# Altium schematic sheet RF.SchDoc
size A4; SheetNumber: 1; SheetTotal: 2
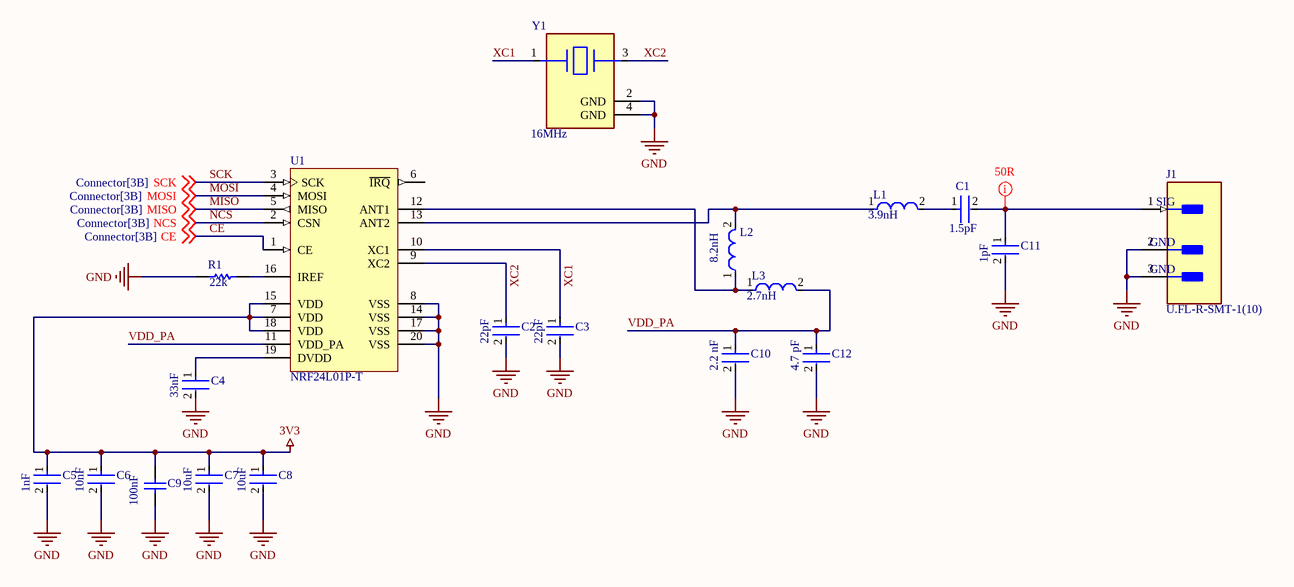
[diagram p0: RF.SchDoc]

## Parts
C1  Capacitance: 1.5pF  [FP-GCM155-0_05-IPC_C]  (hidden comment: GCM1555C1H1R5BA16D)
C2  Capacitance: 22pF  [FP-0402-L_1_0_1-W_0_5_0_1-MFG]  (hidden comment: 04025A220JAT2A)
C3  Capacitance: 22pF  [FP-0402-L_1_0_1-W_0_5_0_1-MFG]  (hidden comment: 04025A220JAT2A)
C4  Capacitance: 33nF  [FP-GCM155-0_05-IPC_A]  (hidden comment: GCM155R71E333KA55D)
C5  Capacitance: 1nF  [FP-CL957-IPC_C]  (hidden comment: CL05B102KB5NNNC)
C6  Capacitance: 10nF  [FP-CL165-IPC_C]  (hidden comment: CL05B103KB5NNNC)
C7  Capacitance: 10uF  [FP-LMK107BJ106MALTD-MFG]  (hidden comment: LMK107BJ106MALTD)
C8  Capacitance: 10uF  [FP-LMK107BJ106MALTD-MFG]  (hidden comment: LMK107BJ106MALTD)
C9  value 100nF  [CAPC1050X55X23ML05T13]  (hidden comment: CL05B104KO5NNNC)
C10  value 2.2 nF  [FP-CC0402-MFG]  (hidden comment: CC0402KRX7R9BB222)
C11  Capacitance: 1pF  [FP-GJM155-0_05-IPC_B]  (hidden comment: GJM1555C1H1R0WB01D)
C12  value 4.7 pF  [FP-AC0402-0_5-MFG]  (hidden comment: AC0402CRNPO9BN4R7)
J1  U.FL-R-SMT-1(10)  [FP-U_FL-R-SMT-1_10-MFG]
L1  Inductance: 3.9nH  [FP-LQW15AN_00-W0_6-0_1-MFG]  (hidden comment: LQW15AN3N9B00D)
L2  Inductance: 8.2nH  [FP-LQW15AN_00-W0_6-0_1-MFG]  (hidden comment: LQW15AN8N2G00D)
L3  Inductance: 2.7nH  [FP-LQW15AN_00-W0_6-0_1-MFG]  (hidden comment: LQW15AN2N7B00D)
R1  value 22k  [RESC1005X40X25NL05T10]  (hidden comment: RC0402FR-0722KL)
U1  NRF24L01P-T  [NRSC-QFN-20_L]
Y1  Frequency: 16MHz  [FP-ABM11-MFG]  (hidden comment: X201616MPB4SC)

## Nets
3V3: C5.1 C6.1 C7.1 C8.1 C9.1 U1.7(VDD) U1.15(VDD) U1.18(VDD)
GND: C2.2 C3.2 C4.2 C5.2 C6.2 C7.2 C8.2 C9.2 C10.2 C11.2 C12.2 J1.2(GND) J1.3(GND) R1.1 U1.8(VSS) U1.14(VSS) U1.17(VSS) U1.20(VSS) Y1.2(GND) Y1.4(GND)
CE: U1.1(CE) ; off-sheet CE
MISO: U1.5(MISO) ; off-sheet MISO
MOSI: U1.4(MOSI) ; off-sheet MOSI
NCS: U1.2(CSN) ; off-sheet NCS
SCK: U1.3(SCK) ; off-sheet SCK
VDD_PA: C10.1 C12.1 L3.2 U1.11(VDD_PA)
XC1: C3.1 U1.10(XC1) Y1.1
XC2: C2.1 U1.9(XC2) Y1.3
NetC1_1: C1.1 L1.2
NetC1_2: C1.2 C11.1 J1.1(SIG)
NetC4_1: C4.1 U1.19(DVDD)
NetL1_1: L1.1 L2.2 U1.13(ANT2)
NetL2_1: L2.1 L3.1 U1.12(ANT1)
NetR1_2: R1.2 U1.16(IREF)

Not connected (* = marked no-connect by the designer): U1 6(~{IRQ})

## Layout directives
net class 50R: NetC1_2

## Library data of the parts
C1 = CMP-06035-019024-1: Ceramic Capacitor for Automotive 1.5pF ±0.1pF 50VDC C0G 0402 Paper T/R; Voltage Rating: 50V; Packaging: Tape and Reel; Case Code (Metric): 1005; Mount: Surface Mount; Max Operating Temperature: 125°C; Case/Package: 0402; Min Operating Temperature: -55°C; Case Code (Imperial): 0402; Ratings: AEC-Q200; JLCPartNum: C126500
C2 C3 = CMP-2008-02613-2: General Purpose Ceramic Capacitor, 0402, 22pF, 5%, C0G, 30ppm/°C, 50V; Temperature Coefficient: 30ppm/°C; Mount: Surface Mount; Length: 1mm; Construction: Flat; Contact Plating: Tin; REACH SVHC: No SVHC; Case/Package: 0402; Voltage: 50V; Case Code (Imperial): 0402; Thickness: 0.022inch; Radiation Hardening: No; Number of Pins: 2; Tolerance: 5%; Max Operating Temperature: 125°C; RoHS Compliant: Yes; Voltage Rating: 50V; Case Code (Metric): 1005; Package Quantity: 1; Width: 0.02inch; Termination: SMD/SMT; Lead Free: Lead Free; Height: 0.5mm; Voltage Rating (DC): 50V; Min Operating Temperature: -55°C; Series: -; Depth: 0.5mm; Dielectric: C0G; Packaging: Tape and Reel; JLCPartNum: C694268
C4 = CMP-2008-03719-2: Ceramic Capacitor for Automotive 33nF ±10% 25VDC X7R 0402 Paper T/R; Voltage Rating: 25V; Case Code (Imperial): 0402; Packaging: Tape and Reel; Package Quantity: 10000; Dielectric: X7R; Depth: 0.5mm; Max Operating Temperature: 125°C; Case Code (Metric): 1005; Termination: SMD/SMT; Height: 0.5mm; Width: 0.02inch; REACH SVHC: No SVHC; Tolerance: 10%; Voltage Rating (DC): 25V; Ratings: AEC-Q200; Radiation Hardening: No; Mount: Surface Mount; Min Operating Temperature: -55°C; Thickness: 0.022inch; Case/Package: 0402; Length: 1mm; Lead Free: Lead Free; JLCPartNum: C185046
C5 = CMP-13271-004091-1: Cap Ceramic 1nF 50V X7R ±10% SMD 0402 +125°C Paper T/R; Tolerance: 10%; Material: Ceramic; Lead Free: Lead Free; Dielectric: X7R; Min Operating Temperature: -55°C; Mount: Surface Mount; Package Quantity: 1; Width: 0.02inch; Max Operating Temperature: 125°C; Case/Package: 0402; Depth: 0.5mm; Contact Plating: Tin; Height: 0.5mm; Length: 1mm; Case Code (Imperial): 0402; Voltage Rating (DC): 50V; Voltage: 50V; Radiation Hardening: No; Thickness: 0.022inch; Case Code (Metric): 1005; Packaging: Tape and Reel; Voltage Rating: 50V; JLCPartNum: C14442
C6 = CMP-13271-000387-1: Cap Ceramic 10nF 50V X7R ±10% SMD 0402 +125°C Paper T/R; Depth: 0.5mm; Length: 1mm; Lead Free: Lead Free; Case Code (Metric): 1005; Width: 0.02inch; Min Operating Temperature: -55°C; Thickness: 0.022inch; Package Quantity: 1; Mount: Surface Mount; Height: 0.5mm; Voltage: 50V; Material: Ceramic; Tolerance: 10%; Case Code (Imperial): 0402; Radiation Hardening: No; Case/Package: 0402; Max Operating Temperature: 125°C; Voltage Rating (DC): 50V; Contact Plating: Tin; Packaging: Tape and Reel; Voltage Rating: 50V; Dielectric: X7R; JLCPartNum: C15195
C7 C8 = CMP-2000-05443-2: CAP CER 10UF 10V X5R 0603; Tolerance: 20%; Series: M; Case Code (Metric): 1608; Height: 0.8mm; Resistor Type: Ceramic; Length: 1.6mm; REACH SVHC: No SVHC; Package Quantity: 4000; Lead Free: Lead Free; Voltage Rating (DC): 10V; Thickness: 0.035inch; Width: 0.031inch; Max Operating Temperature: 85°C; Number of Pins: 2; RoHS Compliant: Yes; Voltage Rating: 10V; Case/Package: 0603; Termination: SMD/SMT; Min Operating Temperature: -55°C; Dielectric: X5R; Construction: Flat; Packaging: Tape and Reel; Mount: Surface Mount; Case Code (Imperial): 0603; JLCPartNum: C18800
C9 = CMP-2000-05439-1: Chip Capacitor, 100 nF, +/- 10%, 16 V, -55 to 125 degC, 0402 (1005 Metric), RoHS, Tape and Reel; Manufacturer: Samsung Electro-Mechanics; Capacitance: 100000pF; Dielectric: X7R; Rated Voltage: 16V; Case Size/Dimension: 0402; Tolerance (%): ±10%; Manufacturer URL: http://www.samsungsem.com/global/index.jsp; Datasheet URL: https://datasheet.ciiva.com/29198/458718-da-01-en-vs-kondensator-0402-29198423.pdf; Datasheet Version: Nov-10; JLCPartNum: C1525
C10 = CMP-1034-01742-2: CAP CER 2200PF 50V X7R 0402; Manufacturer: YAGEO; Material: Ceramic; Automotive Grade: NA; Temperature Coefficient: 30ppm/°C; Tolerance: 0.1; Footprint Url: http://www.yageo.com/exep/pages/download/literatures/UPY-C_GEN_24.pdf; Temperature: -55°C to +125°C; RoHS: TRUE; Mouser Description: Multilayer Ceramic Capacitors MLCC - SMD/SMT 2.2nF 50V X7R 10%; Temperature Range Low: -55°C; ComponentLink2URL: http://www.yageo.com/documents/recent/UPY-GP_NP0_16V-to-50V_16.pdf; Digikey Description: CAP CER 2200PF 50V X7R 0402; Manufacturer Part Number: CC0402KRX7R9BB222; Device Class L3: Ceramic Capacitors; Lead Free: Yes; Octopart: https://octopart.com/cc0402krx7r9bb222-yageo-39467642; Package: CC0402; ComponentLink2Description: Datasheet; Category: Cap; Device Class L1: Passive Components; Height: 0.55mm; Temperature Characteristic: X7R; Device Class L2: Capacitors; Voltage Rating: 50 V; Ipc Land Pattern Name: CAPC10050X50; Capacitance: 2.2 nF; Temperature Range High: +125°C; Automotive: No; JLCPartNum: C106861
C11 = CMP-2008-03760-2: Multi-Layer Ceramic Capacitor 1pF C0G  ±0.05pF 0402 Paper T/R; Voltage Rating (DC): 50V; Length: 1mm; Height: 0.5mm; Thickness: 0.022inch; Dielectric: C0G; Case/Package: 0402; Packaging: Tape and Reel; Mount: Surface Mount; Case Code (Imperial): 0402; Case Code (Metric): 1005; Radiation Hardening: No; Min Operating Temperature: -55°C; Voltage: 50V; Voltage Rating: 50V; Lead Free: Lead Free; Depth: 0.5mm; Max Operating Temperature: 125°C; Width: 0.5mm; Package Quantity: 10000; Termination: SMD/SMT; JLCPartNum: C72134
C12 = CMP-03422-000491-1: CAP CER 4.7PF 50V NPO 0402; Manufacturer: Yageo; Material: Ceramic; Tolerance: 0.0025; Automotive Grade: Grade 1; Temperature Coefficient: 30ppm/°C; Description: AC0402 4.7 pF NPO 0.25% 50 V; RoHS: TRUE; Automotive: Yes; Lead Free: Yes; Capacitance: 4.7 pF; Mouser Description: Cap Ceramic 4.7pF 50V C0G 0.25pF Pad SMD 0402 125°C Automotive T/R; Temperature Characteristic: NPO; ComponentLink2URL: http://www.yageo.com/documents/recent/UPY-AC_NP0X7R_16V-to-630V_12.pdf; Device Class L3: Ceramic Capacitors; Voltage Rating: 50 V; Temperature Range High: +125°C; Height: 0.55mm; Device Class L2: Capacitors; Ipc Land Pattern Name: CAPC10050X50; Footprint Url: http://www.yageo.com/exep/pages/download/literatures/UPY-C_GEN_24.pdf; Octopart: https://octopart.com/ac0402crnpo9bn4r7-yageo-76907315; Device Class L1: Passive Components; Category: Cap; Manufacturer Part Number: AC0402CRNPO9BN4R7; Temperature Range Low: -55°C; Package: AC0402-0.5; ComponentLink2Description: Datasheet; Digikey Description: CAP CER 4.7PF 50V NPO 0402; Temperature: -55°C to +125°C; JLCPartNum: C726112
J1 = CMP-2000-05152-3: CONN U.FL RCPT STR 50 OHM SMD; Max Frequency: 6GHz; Connector Type: Coaxial; Body Plating: Silver; Body Material: Bronze; Impedance: 50R; Dielectric Material: Polymer; Insulation Resistance: 500MR; Gender: Male; Packaging: Cut Tape; Length: 3mm; Package Quantity: 2500; Termination: Solder; Lead Free: Lead Free; Series: U.FL; Min Operating Temperature: -40°C; Fastening Type: Snap; Contact Material: Brass; Orientation: Straight; Wire/Cable Type: Coaxial; Frequency: 6GHz; Contact Plating: Gold; Depth: 3.1mm; Weight: 0.001764oz; Max Operating Temperature: 90°C; Radiation Hardening: No; REACH SVHC: No SVHC; Mount: Surface Mount; Housing Color: Beige; JLCPartNum: C88373
L1 = CMP-06042-000827-1: Wire Wound RF Inductor 3.9nH ±0.1nH 750mA 0.07Ω 0402 (1005); Shielding: Unshielded; Self Resonant Frequency: 10GHz; Core Material: Air; Test Frequency: 100MHz; DC Resistance (DCR): 70mR; Length: 1mm; Height: 0.5mm; Case Code (Metric): 1005; Lead Free: Lead Free; Military Standard: Not; Mount: Surface Mount; Current: 750mA; REACH SVHC: No SVHC; Current Rating: 750mA; DC Current: 750mA; Max Operating Temperature: 125°C; Package Quantity: 10000; Packaging: Tape and Reel; Case/Package: 0402; Min Operating Temperature: -55°C; Width: 0.02inch; Depth: 0.7mm; Termination: SMD/SMT; Weight: 2.8E-05oz; Number of Pins: 2; Radiation Hardening: No; Max DC Current: 750mA; Case Code (Imperial): 0402; JLCPartNum: C98062
L2 = CMP-2000-06598-2: Wire Wound RF Inductor 8.2nH ±2% 540mA 0.14Ω 0402 (1005); DC Resistance (DCR): 140mR; Core Material: Air; Q Factor: 25; Test Frequency: 100MHz; Shielding: Unshielded; Self Resonant Frequency: 5.5GHz; DC Current: 540mA; Max DC Current: 540mA; Inductance Tolerance: 2%; Max Operating Temperature: 125°C; Lead Free: Lead Free; Termination: SMD/SMT; Current Rating: 540mA; Depth: 0.7mm; Packaging: Tape and Reel; Mount: Surface Mount; Package Quantity: 10000; Length: 1mm; Case/Package: 0402; Number of Pins: 2; Military Standard: Not; REACH SVHC: No SVHC; Tolerance: 2%; Width: 0.02inch; Case Code (Imperial): 0402; Radiation Hardening: No; Weight: 2.8E-05oz; Min Operating Temperature: -55°C; Height: 0.5mm; Case Code (Metric): 1005; JLCPartNum: C84404
L3 = CMP-06042-004544-1: Wire Wound RF Inductor 2.7nH ±0.1nH 850mA 0.05Ω 0402 (1005); DC Resistance (DCR): 50mR; Self Resonant Frequency: 15GHz; Core Material: Air; Q Factor: 20; Test Frequency: 100MHz; Shielding: Unshielded; Current: 750mA; Mount: Surface Mount; Max DC Current: 850mA; DC Current: 850mA; Termination: SMD/SMT; Case Code (Metric): 1005; Radiation Hardening: No; Min Operating Temperature: -55°C; Max Operating Temperature: 125°C; Lead Free: Lead Free; Case/Package: 0402; Package Quantity: 10000; Case Code (Imperial): 0402; Depth: 0.7mm; Current Rating: 850mA; Width: 0.02inch; Length: 1mm; Height: 0.5mm; Weight: 2.8E-05oz; Packaging: Tape and Reel; REACH SVHC: No SVHC; Military Standard: Not; JLCPartNum: C91239
R1 = CMP-2002-07517-1: Manufacturer: Yageo / Phycomp; Part Number: RC0402FR-0722KL; JLCPartNum: C82868
U1 = CMP-2000-06859-1: Single Chip Transceiver, 2.4 GHz, 60 mW, 1.9 to 3.6 V, -40 to 85 degC, 20-Pin QFN, RoHS, Tray; Manufacturer: Nordic Semiconductor; Data Rate (Max): 2Mbps; Current - Transmitting: 7mA~11.3mA; Power - Output: 0dBm; Other Names: 1490-1019; Online Catalog: nRF24L01+; Current - Receiving: 12.6mA~13.5mA; For Use With: 1490-1002-ND-KITEVALUATIONNRF24L01P1568-1295-ND-SPARKFUNTRANSCEIVERBREAKOUT-1568-1296-ND-SPARKFUNTRANSCEIVERBREAKOUT-1471-1410-ND-DEVBOARDNRFSCLICKNRF24L01P-MODULE-PCB-ND-KITEVALNRF24L01+PCBANTENNANRF24L01P-MODULE-SMA-ND-KITEVALNRF24L01+SMACONNNRF24L01P-UPGRADE-ND-UPGRADE2PCB/1SMANRF24L01103990038-ND-DEVDUINOSENSORNODEV1.3103990053-ND-DEVDUINOSENSORNODEV2(ATMEGA103990074-ND-DEVDUINOSENSORNODE106990026-ND-ENERGYMONITORSHIELDV2113990088-ND-WIRELESSGATESHIELD113990095-ND-DEVDUINOSENSORNODEV3(ATMEGA106030001-ND-ENERGYMONITORSHIELD1597-1361-ND-DEVDUINOSENSORNODEV2.2(ATMEG105990030-ND-RGBWSTRIPWIRELESSSHIELDV1.0; Frequency: 2.4GHz; Design Resources: DevelopmentToolSelector; RF Family/Standard: GeneralISM>1GHZ; Serial Interfaces: SPI; Sensitivity: -94dBm; Voltage - Supply: 1.9V~3.6V; Modulation: GFSK; GPIO: -; Package Reference: QFN20; Memory Size: -; Category: RF/IFandRFID; Type: TxRxOnly; Standard Package: 490; Package / Case: 20-VFQFNExposedPad; Packaging: Tray; Series: -; Package Description: 20-Pin Quad Flat No-lead Package, Body 4 x 4 mm, Pitch 0.5 mm; Datasheet Version: Rev. 1.0, 09/2008; Protocol: -; Manufacturer URL: http://www.nordicsemi.com/eng/Products/; Operating Temperature: -40°C~85°C; Family: RFTransceiverICs; Datasheet URL: http://www.nordicsemi.com/eng/content/download/2726/34069/file/nRF24L01P_Product_Specification_1_0.pdf; Mounting Technology: SurfaceMount; JLCPartNum: C1526140
Y1 = CMP-27762-009948-1: Crystal 16MHz ±15ppm 15pF SMD-4 2mm x 1.6mm; ESR (Equivalent Series Resistance): 80R; Operating Frequency: 15 MHz; Height: 0.023inch; Min Operating Temperature: -20°C; Lead Free: Lead Free; Packaging: Tape and Reel; Package Quantity: 1000; Width: 1.6mm; Mount: Surface Mount; Frequency Tolerance: 15ppm; Termination: SMD/SMT; Length: 0.079inch; Series Resistance: 80R; Frequency Stability: 15ppm; Load Capacitance: 15pF; Tolerance: 15ppm; Number of Pins: 4; Max Operating Temperature: 70°C; Case/Package: SMD/SMT; REACH SVHC: No SVHC; JLCPartNum: C1985805